# EAGLE design PIIzza TIme updated (EAGLE 9.1.3)

## Sheet 1 of 2
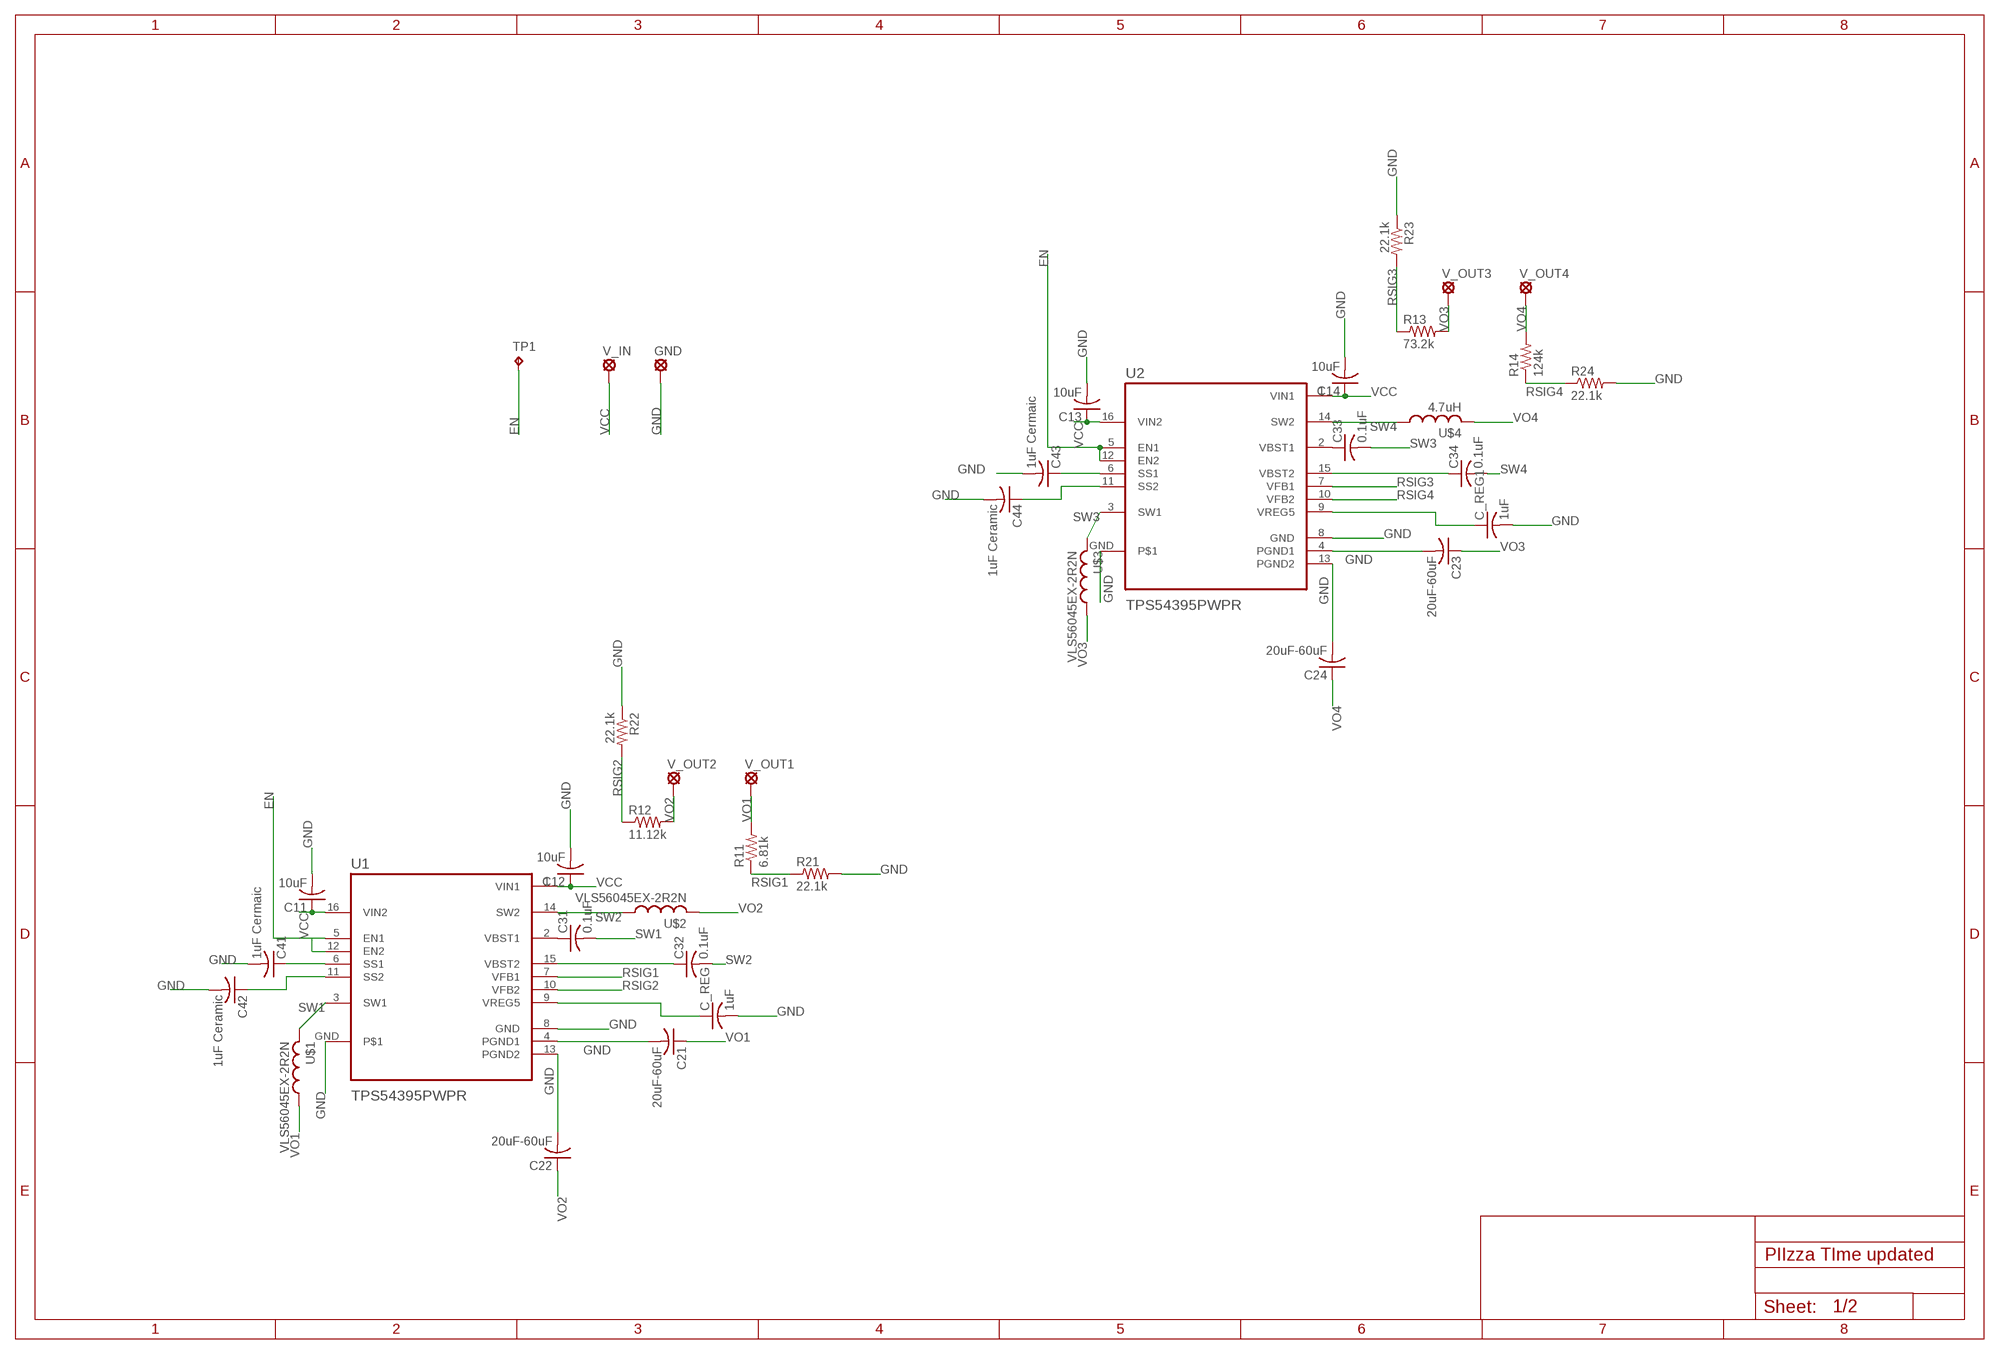
[diagram p0: schematic, sheet 1]

### Parts
C11  10uF  C-USC0805  [C0805]
C12  10uF  C-USC0805  [C0805]
C13  10uF  C-USC0805  [C0805]
C14  10uF  C-USC0805  [C0805]
C21  20uF-60uF  C-USC0805  [C0805]
C22  20uF-60uF  C-USC0805  [C0805]
C23  20uF-60uF  C-USC0805  [C0805]
C24  20uF-60uF  C-USC0805  [C0805]
C31  0.1uF  C-USC0805  [C0805]
C32  0.1uF  C-USC0805  [C0805]
C33  0.1uF  C-USC0805  [C0805]
C34  0.1uF  C-USC0805  [C0805]
C41  1uF Cermaic  C-USC0805  [C0805]
C42  1uF Ceramic  C-USC0805  [C0805]
C43  1uF Cermaic  C-USC0805  [C0805]
C44  1uF Ceramic  C-USC0805  [C0805]
C_REG  1uF  C-USC0805  [C0805]
C_REG1  1uF  C-USC0805  [C0805]
GND  SE11  [SE11]
R11  6.81k  R-US_M0805  [M0805]
R12  11.12k  R-US_M0805  [M0805]
R13  73.2k  R-US_M0805  [M0805]
R14  124k  R-US_M0805  [M0805]
R21  22.1k  R-US_M0805  [M0805]
R22  22.1k  R-US_M0805  [M0805]
R23  22.1k  R-US_M0805  [M0805]
R24  22.1k  R-US_M0805  [M0805]
TP1  TPB1,27  [B1,27]
U1  TPS54395PWPR  [SOP65P640X120-17N]
U2  TPS54395PWPR  [SOP65P640X120-17N]
U$1  VLS56045EX-2R2N  [VLS]
U$2  VLS56045EX-2R2N  [VLS]
U$3  VLS56045EX-2R2N  [VLS]
U$4  4.7uH  VLS56045EX-2R2N  [VLS]
V_IN  LSP11  [LSP11]
V_OUT1  LSP11  [LSP11]
V_OUT2  LSP11  [LSP11]
V_OUT3  LSP11  [LSP11]
V_OUT4  LSP11  [LSP11]

### Nets
EN: TP1.TP U1.5(EN1) U1.12(EN2) U2.5(EN1) U2.12(EN2)
GND: C11.2 C12.2 C13.2 C14.2 C21.2 C22.2 C23.2 C24.2 C41.2 C42.2 C43.2 C44.2 C_REG1.2 C_REG.2 GND.MP R21.2 R22.1 R23.1 R24.2 U1.4(PGND1) U1.8(GND) U1.13(PGND2) U1.GND U2.4(PGND1) U2.8(GND) U2.13(PGND2) U2.GND ; also sheet 2
N$1: C41.1 U1.6(SS1)
N$2: C42.1 U1.11(SS2)
N$3: C31.1 U1.2(VBST1)
N$4: C32.1 U1.15(VBST2)
N$5: C_REG.1 U1.9(VREG5)
N$6: C43.1 U2.6(SS1)
N$7: C44.1 U2.11(SS2)
N$8: C33.1 U2.2(VBST1)
N$9: C34.1 U2.15(VBST2)
N$10: C_REG1.1 U2.9(VREG5)
RSIG1: R11.1 R21.1 U1.7(VFB1)
RSIG2: R12.1 R22.2 U1.10(VFB2)
RSIG3: R13.1 R23.2 U2.7(VFB1)
RSIG4: R14.1 R24.1 U2.10(VFB2)
SW1: C31.2 U1.3(SW1) U$1.P$2
SW2: C32.2 U1.14(SW2) U$2.P$1
SW3: C33.2 U2.3(SW1) U$3.P$2
SW4: C34.2 U2.14(SW2) U$4.P$1
VCC: C11.1 C12.1 C13.1 C14.1 U1.1(VIN1) U1.16(VIN2) U2.1(VIN1) U2.16(VIN2) V_IN.MP
VO1: C21.1 R11.2 U$1.P$1 V_OUT1.MP
VO2: C22.1 R12.2 U$2.P$2 V_OUT2.MP
VO3: C23.1 R13.2 U$3.P$1 V_OUT3.MP ; also sheet 2
VO4: C24.1 R14.2 U$4.P$2 V_OUT4.MP

## Sheet 2 of 2
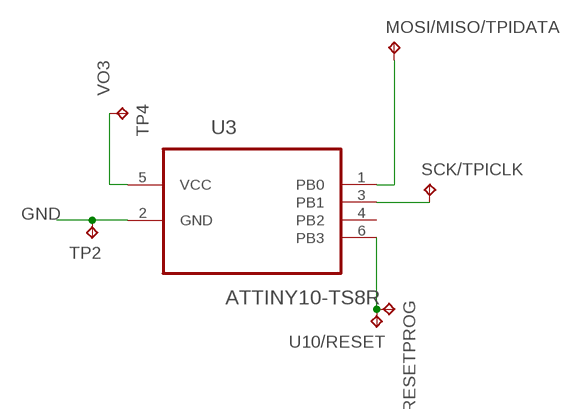
[diagram p1: schematic, sheet 2]

### Parts
MOSI/MISO/TPIDATA  TPB2,54  [B2,54]
RESETPROG  TPB2,54  [B2,54]
SCK/TPICLK  TPB2,54  [B2,54]
TP2  TPB2,54  [B2,54]
TP4  TPB2,54  [B2,54]
U3  ATTINY10-TS8R  [SOT95P280X145-6N]
U10/RESET  TPB2,54  [B2,54]

### Nets
DIS_BAT_LIFE: RESETPROG.TP U3.6(PB3) U10/RESET.TP
GND: TP2.TP U3.2(GND) ; also sheet 1
N$11: MOSI/MISO/TPIDATA.TP U3.1(PB0)
N$13: SCK/TPICLK.TP U3.3(PB1)
VO3: TP4.TP U3.5(VCC) ; also sheet 1
Unconnected: U3.4(PB2)

## Library data of the parts
C11-C14 C21-C24 C31-C34 C41-C44 C_REG C_REG1 = rcl:C-US: CAPACITOR, American symbol; SPICEPREFIX: C
GND = solpad:SE11: SOLDER PAD RTM, drill 1,1mm, distributor Buerklin, 07F810
MOSI/MISO/TPIDATA RESETPROG SCK/TPICLK TP1 TP2 TP4 U10/RESET = testpad:TP: Test pad
R11-R14 R21-R24 = resistor:R-US_: RESISTOR, American symbol
U1 U2 = TPS54395PWPR:TPS54395PWPR: None; AVAILABILITY: Unavailable; DESCRIPTION: 4.5V to 18V Input, Dual 3A Output, Synchronous Step-Down Converter 16-HTSSOP -40 to 85; MF: Texas Instruments; MP: TPS54395PWPR; PACKAGE: HTSSOP-16 Texas Instruments; PRICE: None
U3 = ATTINY10-TS8R:ATTINY10-TS8R: 8-bit Microcontroller with In-System Programmable Flash; AVAILABILITY: Unavailable; DESCRIPTION: Embedded microcontroller ATTINY10-TS8R SOT 23 Microchip Technology 8-Bit 10 MHz I/O number 4; MF: Microchip; MP: ATTINY10-TS8R; PACKAGE: SOT-23-6 Microchip; PRICE: None
U$1-U$4 = Inductor_VLS56045-2R2N:VLS56045EX-2R2N
V_IN V_OUT1-V_OUT4 = solpad:LSP11: SOLDER PAD drill 1.1 mm

## Net classes
0 default: width 0.203 mm

## Board
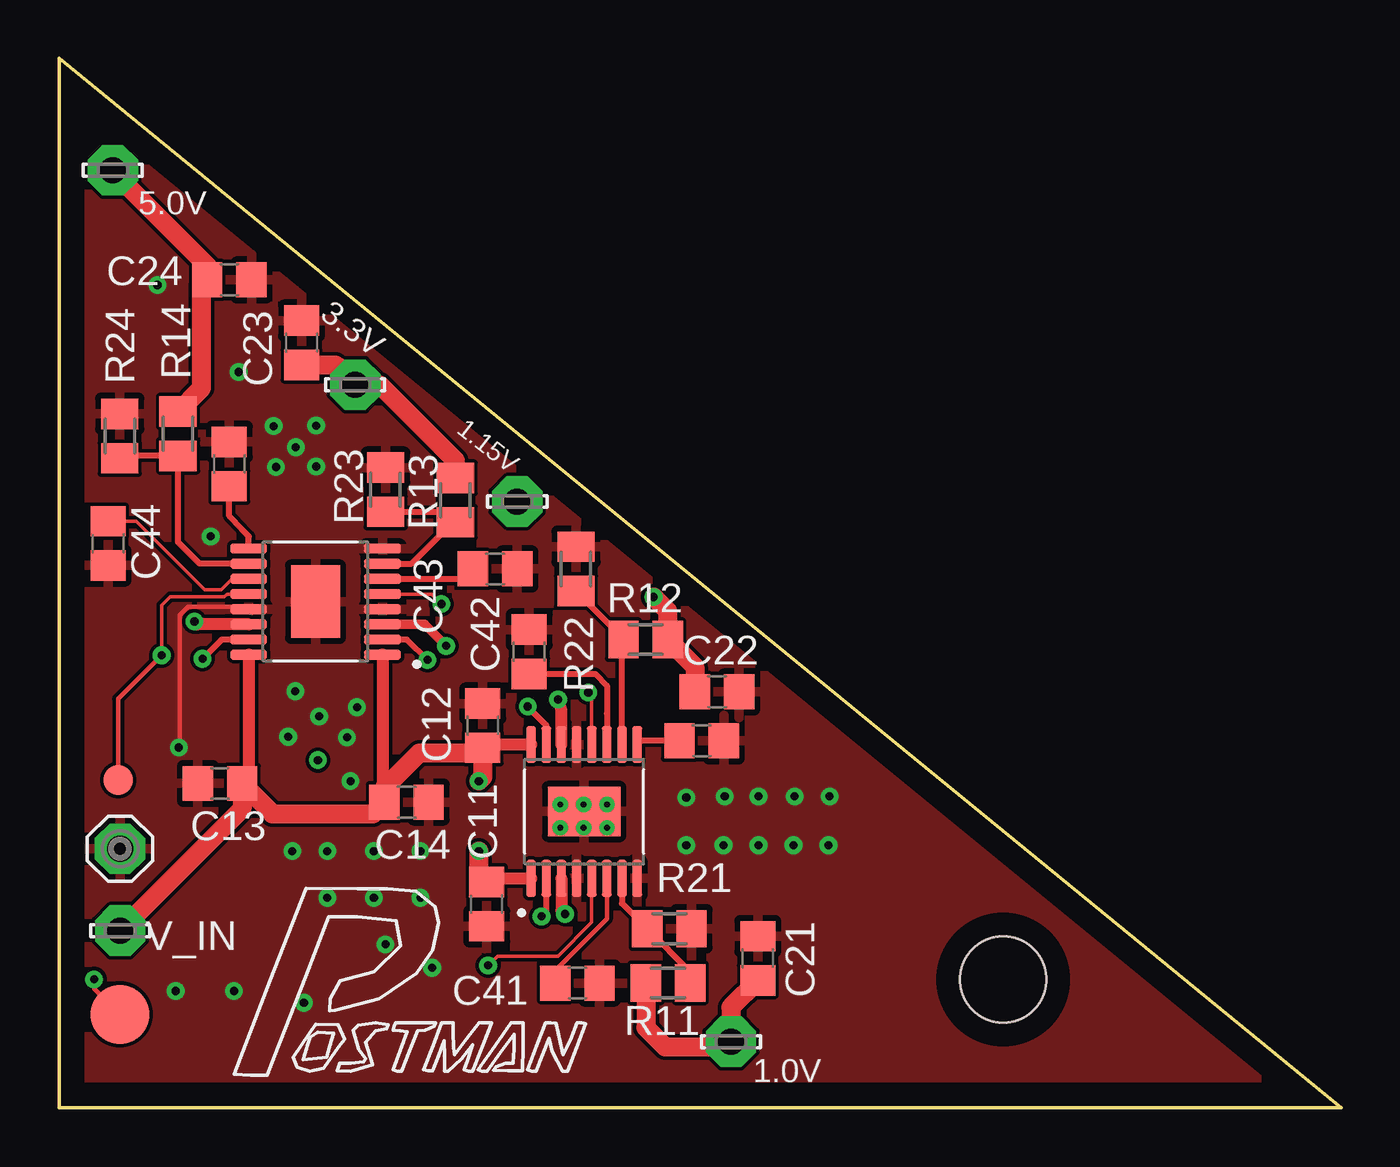
[diagram p2: board, top side]
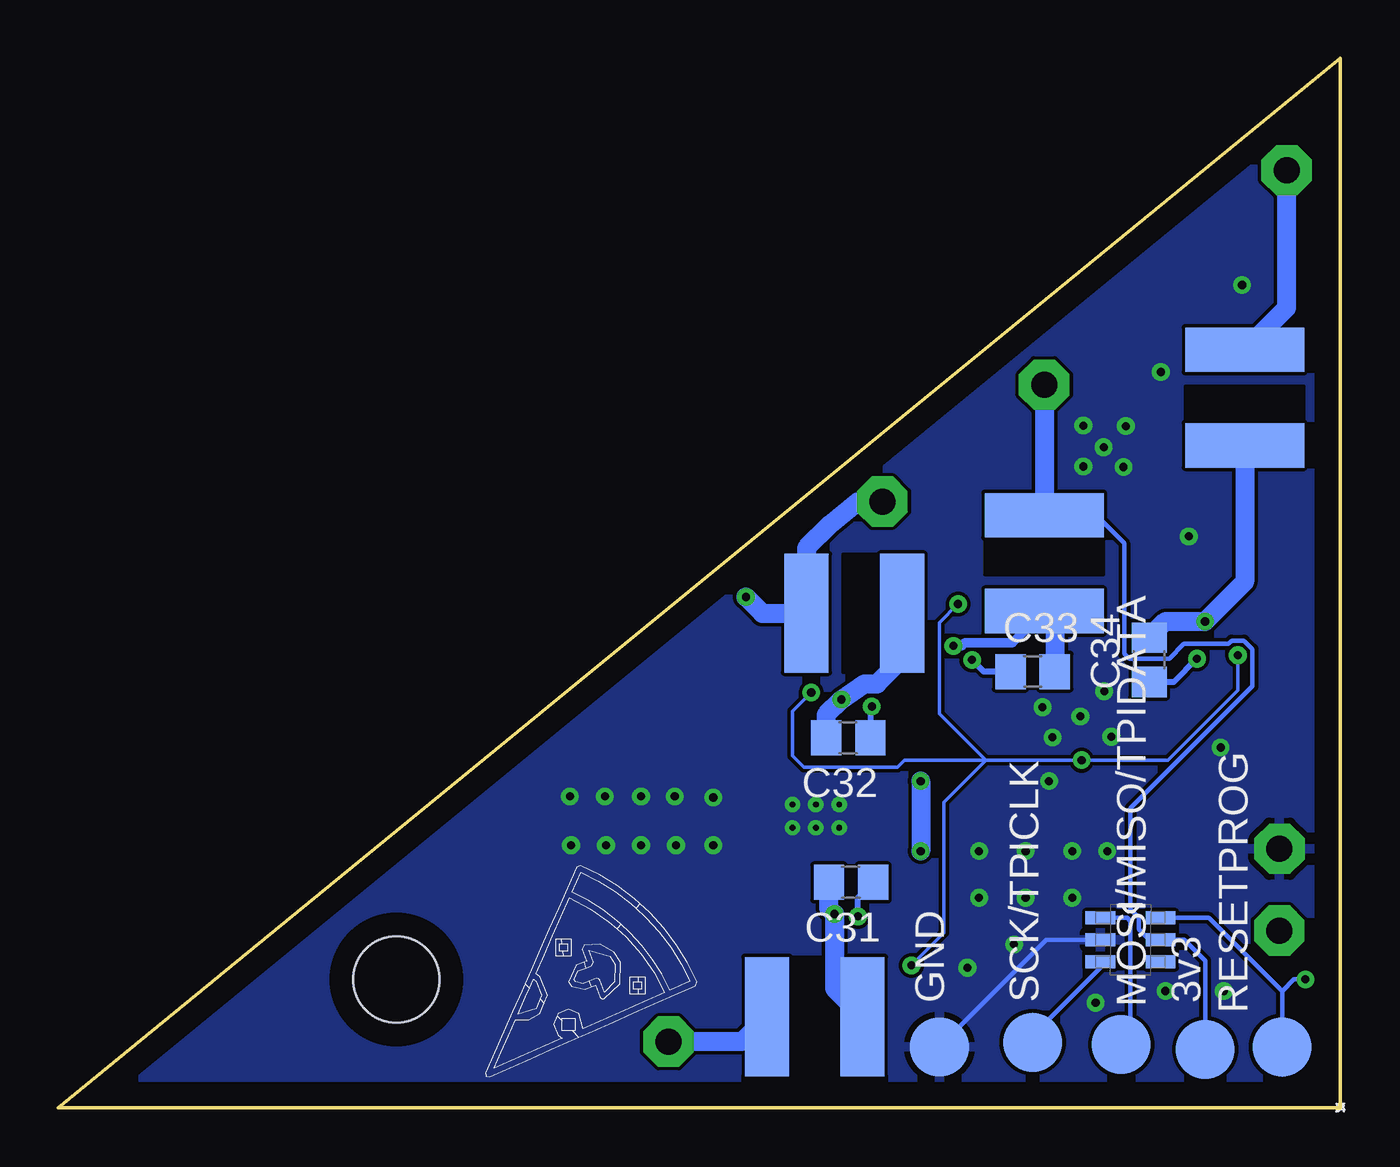
[diagram p3: board, bottom side, seen from below]

Size 55 x 45 mm. Coordinates in mm from the lower left corner, seen from the top.
Outline: 0,0 0,45 55,0 0,0
Copper layers (1*16): Top 0.035mm / dielectric 1.5mm / Bottom 0.035mm
Design rules "default *": minimum track width 6mil, minimum drill 0.35mm, track to track 6mil, track to pad 6mil, pad to pad 6mil, via to via 6mil, smd to smd 6mil, copper to edge 40mil, drill to drill 6mil, minimum pad ring 10mil, minimum via ring 8mil, stop-mask expansion 4mil, vias tented up to drill 36mil, thermal gap 10mil
Holes 3.7 mm at 40.5,5.5

### Footprints (pad centres in the part's own frame; a part is rotated, then mirrored left to right if it is on the bottom)
C0805 = smd 1.3 x 1.5: 1 -0.95,0; 2 0.95,0
SE11 = drill 1.118 pad 2.159 octagon: MP 0,0
B2,54 = smd 2.54 x 2.54: TP 0,0
M0805 = smd 1.3 x 1.6: 1 -0.95,0; 2 0.95,0
B1,27 = smd 1.27 x 1.27: TP 0,0
SOP65P640X120-17N = smd 1.57 x 0.41: 1 -2.87,2.275; 2 -2.87,1.625; 3 -2.87,0.975; 4 -2.87,0.325; 5 -2.87,-0.325; 6 -2.87,-0.975; 7 -2.87,-1.625; 8 -2.87,-2.275; 9 2.87,-2.275; 10 2.87,-1.625; 11 2.87,-0.975; 12 2.87,-0.325; 13 2.87,0.325; 14 2.87,0.975; 15 2.87,1.625; 16 2.87,2.275 | smd 2.105 x 3.115: GND 0,0
SOT95P280X145-6N = smd 1.27 x 0.559: 1 -1.295,0.94; 2 -1.295,0; 3 -1.295,-0.94; 4 1.295,-0.94; 5 1.295,0; 6 1.295,0.94
VLS = smd 1.9 x 5.1: P$1 0,0; P$2 4.1,0
LSP11 = drill 1.118 pad 2.159 octagon: MP 0,0

### Placement (x,y rotation side)
C11  18.34,8.73 270 top
C12  18.17,16.38 90 top
C13  6.9,13.9 180 top
C14  14.9,13.1 0 top
C21  29.97,6.4 90 top
C22  28.22,17.83 0 top
C23  10.4,32.8 90 top
C24  7.3,35.5 0 top
C31  20.99,9.66 180 bottom
C32  21.11,15.86 180 bottom
C33  13.2,18.7 0 bottom
C34  8.2,19.2 90 bottom
C41  22.23,5.34 0 top
C42  20.16,19.55 90 top
C43  18.7,23.1 0 top
C44  2.1,24.2 270 top
C_REG  27.56,15.73 0 top
C_REG1  7.3,27.6 90 top
GND  2.61,11.1 0 top
MOSI/MISO/TPIDATA  9.4,2.7 0 bottom
R11  26.12,5.35 180 top
R12  25.16,20.07 0 top
R13  17,26.05 90 top
R14  5.1,28.9 90 top
R21  26.18,7.67 0 top
R22  22.17,23.1 270 top
R23  14,26.5 270 top
R24  2.6,28.8 90 top
RESETPROG  2.5,2.6 0 bottom
SCK/TPICLK  13.2,2.8 0 bottom
TP1  2.53,14.05 0 top
TP2  17.2,2.6 0 bottom
TP4  5.8,2.5 0 bottom
U1  22.52,12.7 90 top
U2  11,21.7 180 top
U3  9,7.2 0 bottom
U10/RESET  2.6,4 90 top
U$1  24.6,3.9 0 bottom
U$2  18.8,21.2 180 bottom
U$3  12.7,25.4 270 bottom
U$4  4.1,28.4 90 bottom
U$5  [LOGO]  3.54,-5.95 0 top  (outside the outline)
U$6  [PIIZATIME]  36.5,1.2 315 bottom
V_IN  2.62,7.59 0 top
V_OUT1  28.82,2.83 0 top
V_OUT2  19.65,25.99 0 top
V_OUT3  12.7,31 0 top
V_OUT4  2.3,40.2 0 top

### Tracks (layer width: path | path; a pad name or v marks a point on that pad's centre or on a via)
DIS_BAT_LIFE  (via drill 0.35)
  Top 0.203: U10/RESET.TP 1.5,5.1 v1.5,5.5
  Bottom 0.203: U3.6 5.64,8.14 2.5,5 | v1.5,5.5 2,5.5 2.5,5 | RESETPROG.TP 2.5,5
EN  (via drill 0.35)
  Top 0.152: U2.5 15.97,22.02 v16.4,21.6 | U2.12 7.21,22.02 7.08,21.9 4.76,21.9 4.4,21.54 v4.4,19.4 | U1.5 22.84,7.95 21.4,6.5 18.8,6.5 v18.4,6.1 | U1.12 22.84,17.66 v22.7,17.8
  Top 0.203: v4.4,19.4 2.53,17.53 TP1.TP
  Bottom 0.152: v16.4,21.6 17.21,20.79 17.21,19.55 17.2,19.54 17.2,16.9 15.2,14.9 | 15.2,14.9 v11.1,14.9 7.4,14.9 4.4,17.9 v4.4,19.4 | v18.4,6.1 17,7.5 17,13.1 15.2,14.9 | v22.7,17.8 23.5,17 23.5,15.1 23,14.6 19,14.6 18.7,14.9 15.2,14.9
GND  (via drill 0.25, 0.35)
  Top 0.203: U2.13 8.39,21.38 8.5,21.48 5.54,21.48 5.17,21.11 5.17,15.48 v5.13,15.44
  Bottom 0.203: U3.2 12.6,7.2 TP2.TP
  other vias: 30,11.25 28.55,13.35 30,13.35 31.55,13.35 33.05,13.35 33,11.25 10.15,28.32 11.15,16.78 10.13,17.86 9.2,29.22 11.02,29.25 11.02,27.5 31.5,11.25 28.5,11.25 26.9,11.25 26.9,13.3 7.7,31.55 9.3,27.47 9.82,15.9 12.35,15.88 4.22,35.28 12.78,17.17 21.5,12 22.5,12 23.5,12 23.5,13 22.5,13 21.5,13 15.5,11 15.5,9 14,7 13.5,11 11.5,11 16,6 11.5,9 10,11 13.5,9 5,5 7.5,5 10.5,4.5 12.5,14 6.5,24.5
  pour Bottom: 0,44.9 55,0 0,0
  pour Top: 0,45 55,0 0,0
N$1
  Top 0.203: U1.6 23.5,8.1 21.28,5.88 C41.1
N$2
  Top 0.254: C42.1 23,18.6 23.5,18.1 23.5,18.09 23.5,16.9 | 23.5,16.9 U1.11 | 23.5,16.9 | 23.5,16.9
N$3  (via drill 0.35)
  Top 0.254: U1.2 20.89,8.4 v20.69,8.2
  Bottom 0.254: v20.69,8.2 20.69,9.01 C31.1
N$4  (via drill 0.35)
  Top 0.254: U1.15 20.89,16.41 v20.1,17.2
  Bottom 0.254: v20.1,17.2 20.16,17.14 C32.1
N$5
  Top 0.254: C_REG.1 24.95,15.73 U1.9
N$6
  Top 0.254: U2.6 17.32,22.68 C43.1
N$7
  Top 0.152: U2.11 7.42,22.68 6.96,22.21 6.24,22.21 3.34,25.11 3.3,25.15 C44.1
N$8  (via drill 0.35)
  Top 0.254: v15.8,19.2 14.93,20.07 U2.2
  Bottom 0.254: C33.1 15.3,18.7 v15.8,19.2
N$9  (via drill 0.35)
  Top 0.254: U2.15 6.97,20.07 v6.15,19.25
  Bottom 0.254: v6.15,19.25 7.15,18.25 C34.1
N$10
  Top 0.254: U2.9 8.13,24.5 7.84,24.79 7.3,25.37 C_REG1.1
N$11
  Bottom 0.203: U3.1 9.14,8.14 9,8 9,3.1 MOSI/MISO/TPIDATA.TP
N$13
  Bottom 0.203: U3.3 10.29,6 12.4,3.9 | 12.4,3.9 12.65,3.65 | 13.2,3.1 SCK/TPICLK.TP 13.2,3.1 | 12.4,3.9 13.2,3.1
RSIG1
  Top 0.254: U1.7 24.14,8.76 R21.1 27.07,5.83 R11.1
RSIG2
  Top 0.254: U1.10 24.14,20 R12.1 24.21,20.11 R22.2
RSIG3
  Top 0.152: 16.5,25 17,25
  Top 0.254: U2.7 15.12,23.32 16.5,24.7 16.5,25 | 17,25 R13.1 16.55,25.55 R23.2
RSIG4
  Top 0.254: U2.10 6.03,23.32 5.1,24.25 R14.1 2.7,27.95 R24.1
SW1  (via drill 0.35)
  Top 0.508: U1.3 21.55,8.46 v21.7,8.3
  Bottom 0.813: U$1.P$2 21.7,5.1 v21.7,8.3 21.94,8.54 C31.2
SW2  (via drill 0.35)
  Top 0.508: U1.14 21.55,17.05 v21.4,17.5
  Bottom 0.813: U$2.P$1 18.8,19.25 19.87,18.18 20.42,18.18 v21.4,17.5 22.06,16.84 C32.2
SW3  (via drill 0.35)
  Top 0.406: U2.3 15.68,20.73 v16.6,19.8
  Bottom 0.406: v16.6,19.8 16.24,19.8 16.1,19.93 14.07,19.93 U$3.P$2
  Bottom 0.813: U$3.P$2 12.25,20.85 C33.2
SW4  (via drill 0.35)
  Top 0.508: U2.14 5.92,20.73 v5.8,20.85
  Bottom 0.813: C34.2 7.5,20.85 v5.8,20.85 4.1,22.55 U$4.P$1
VCC  (via drill 0.35)
  Top 0.508: U2.16 8.13,14.18 C13.1 | U2.1 13.87,13.18 | U1.16 18.31,15.57 C12.1 | C11.1 18.49,9.83 U1.1
  Top 0.813: V_IN.MP 7.85,12.82 C13.1 9.15,12.6 13.45,12.6 C14.1 | C14.1 13.87,13.18 | C14.1 13.95,13.7 15.45,15.2 17.94,15.2 C12.1 18.17,14.17 v18,14 | v18,11 18,10.02 C11.1
  Bottom 0.813: v18,14 v18,11
VO1
  Top 0.813: C21.1 28.82,4.3 V_OUT1.MP 28.59,2.6 26,2.6 25.17,3.43 R11.2
  Bottom 0.813: U$1.P$1 25.67,2.83 V_OUT1.MP
VO2  (via drill 0.35)
  Top 0.813: C22.1 27.27,18.91 R12.2 26.11,21.29 v25.5,21.9
  Bottom 0.813: v25.5,21.9 24.8,21.2 U$2.P$2 22.9,24 21.9,25 20.69,25.99 V_OUT2.MP
VO3
  Top 0.813: C23.1 11.85,31.85 V_OUT3.MP 13.75,31 17,27.75 R13.2
  Bottom 0.203: U$3.P$1 10.46,25.4 9.27,24.21 9.27,19.46 9.05,19.25 7.34,19.25 6.71,19.88 4.81,19.88 4.66,20.03 4.14,20.03 3.77,19.66 3.77,18.07 9,12.83 9,8.5 8.99,8.49 8.64,8.15 8.64,7.64 8.2,7.2 7.5,7.2 | TP4.TP 5.8,6.3 6.7,7.2 7.5,7.2 | 7.5,7.2 U3.5
  Bottom 0.813: V_OUT3.MP U$3.P$1
VO4
  Top 0.813: V_OUT4.MP 2.3,40.15 6.35,36.1 C24.1 6.1,35.25 6.1,30.85 R14.2
  Bottom 0.813: U$4.P$2 2.3,34.3 V_OUT4.MP

### Text on the board
tPlace: 5.0V | 3.3V | 1.15V | 1.0V
bNames: 3v3 | GND